# Altium schematic sheet Interface.SchDoc
size A; SheetNumber: 3; SheetTotal: 3
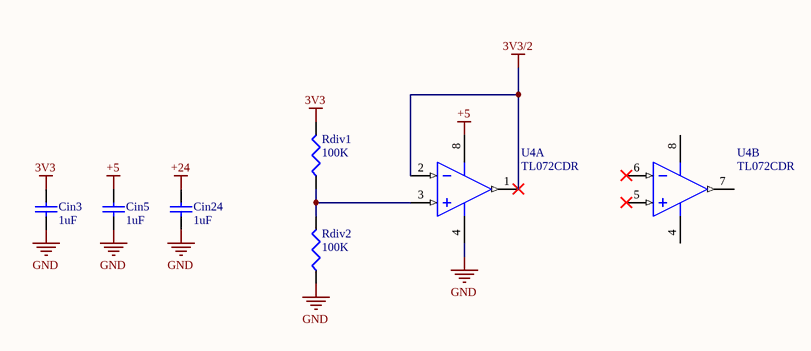
[diagram p0: Interface.SchDoc]

## Parts
Cin3  1uF  [C0805]
Cin5  1uF  [C0805]
Cin24  1uF  [C0805]
Rdiv1  100K  [J1-0603]
Rdiv2  100K  [J1-0603]
U4  TL072CDR  [D0008A_M]  (parts A,B of 2)

## Nets
3V3: Cin3.2 Rdiv1.2
3V3/2: U4.1(OUT1) U4.2(IN1-)
+5: Cin5.2 U4.8(VCC+)
+24: Cin24.2
GND: Cin3.1 Cin5.1 Cin24.1 Rdiv2.1 U4.4(VCC-)
NetRdiv1_1: Rdiv1.1 Rdiv2.2 U4.3(IN1+)

Not connected (* = marked no-connect by the designer): U4 5(IN2+)* 6(IN2-)* 7(OUT2)

## Library data of the parts
Cin3 Cin5 Cin24 = Cap: Capacitor; Published: 8-Jun-2000; LatestRevisionDate: 17-Jul-2002; LatestRevisionNote: Re-released for DXP Platform.; PackageReference: RAD-0.3; Publisher: Altium Limited; PackageDescription: Radial Cap, Thru-Hole; 2 Leads; 0.3 in Pin Spacing
Rdiv1 Rdiv2 = Res3: Resistor; Published: 8-Jun-2000; LatestRevisionDate: 29-May-2009; LatestRevisionNote: IPC-7351 Footprint Added.; PackageReference: J1-0603; Publisher: Altium Limited; PackageDescription: Chip Resistor
U4 = CMP-0017-00628-2: Dual Low-Noise JFET-Input General-Purpose Operational Amplifier, 7 to 36 V, 0 to 70 degC, 8-pin SOIC (D8), Green (RoHS & no Sb/Br); Manufacturer: Texas Instruments; Total Supply Voltage(Min)(+5V is 5, +/-5V is 10): 7; IIB(Max)(pA): 200; Sub Family: General Purpose Amplifier, High Supply Voltage Amplifier (>=30V); Number of Channels: 2; Iq per channel(Max)(mA): 2.5; Total Supply Voltage(Max)(+5V is 5, +/-5V is 10): 36; Vio (25C)(Max)(mV): 10; Offset Drift(Typ)(uV/C): 18; CMRR(Min)(dB): 70; Rating: Catalog; Slew Rate(Typ)(V/us): 13; GBW(Typ)(MHz): 3; ComponentLink1Description: Manufacturer URL; Code_JEDEC: MS-012; ComponentLink3Description: Package Specification; Mounting Technology: Surface Mount; Eco-Plan: Green (RoHS & no Sb/Br); ComponentLink3URL: http://www.ti.com/litv/pdf/msoi002j; ComponentLink1URL: http://www.ti.com/; PackageVersion: 4040047-3/M, 06/2011; ComponentLink2URL: http://www.ti.com/lit/ds/symlink/tl072.pdf; PartNumber: TL072CDR; PackageDescription: 8-Pin Plastic Small Outline, Body 4.9 x 3.9 mm, Pitch 1.27 mm; DatasheetVersion: SLOS080J; Vn at 1kHz(Typ)(nV/rtHz): 18; ComponentLink2Description: Datasheet; PackageReference: D0008A